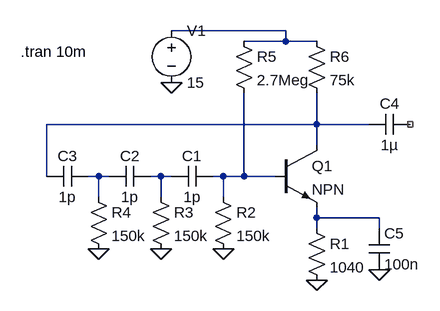
[diagram p0: schematic Project1.asc]
Project1.asc, the LTspice schematic file:
Version 4
SHEET 1 880 680
WIRE 176 -64 0 -64
WIRE 176 -48 176 -64
WIRE 176 -48 112 -48
WIRE 224 -48 176 -48
WIRE 224 80 224 32
WIRE 224 80 -192 80
WIRE 304 80 224 80
WIRE 224 112 224 80
WIRE -192 160 -192 80
WIRE -112 160 -128 160
WIRE -96 160 -112 160
WIRE -16 160 -32 160
WIRE 0 160 -16 160
WIRE 80 160 64 160
WIRE 112 160 112 32
WIRE 112 160 80 160
WIRE 160 160 112 160
WIRE -112 192 -112 160
WIRE -16 192 -16 160
WIRE 80 192 80 160
WIRE 224 224 224 208
WIRE 320 224 224 224
WIRE 224 240 224 224
WIRE 320 240 320 224
FLAG 0 16 0
FLAG -112 272 0
FLAG -16 272 0
FLAG 80 272 0
FLAG 224 320 0
FLAG 320 304 0
SYMBOL npn 160 112 R0
SYMATTR InstName Q1
SYMBOL res 208 224 R0
SYMATTR InstName R1
SYMATTR Value 1040
SYMBOL res 64 176 R0
SYMATTR InstName R2
SYMATTR Value 150k
SYMBOL res -32 176 R0
SYMATTR InstName R3
SYMATTR Value 150k
SYMBOL res -128 176 R0
SYMATTR InstName R4
SYMATTR Value 150k
SYMBOL cap 64 144 R90
WINDOW 0 0 32 VBottom 2
WINDOW 3 32 32 VTop 2
SYMATTR InstName C1
SYMATTR Value 1p
SYMBOL cap -32 144 R90
WINDOW 0 0 32 VBottom 2
WINDOW 3 32 32 VTop 2
SYMATTR InstName C2
SYMATTR Value 1p
SYMBOL cap -128 144 R90
WINDOW 0 0 32 VBottom 2
WINDOW 3 32 32 VTop 2
SYMATTR InstName C3
SYMATTR Value 1p
SYMBOL res 96 -64 R0
SYMATTR InstName R5
SYMATTR Value 2.7Meg
SYMBOL res 208 -64 R0
SYMATTR InstName R6
SYMATTR Value 75k
SYMBOL cap 368 64 R90
WINDOW 0 0 32 VBottom 2
WINDOW 3 32 32 VTop 2
SYMATTR InstName C4
SYMATTR Value 1µ
SYMBOL voltage 0 -80 R0
WINDOW 123 0 0 Left 0
WINDOW 39 0 0 Left 0
SYMATTR InstName V1
SYMATTR Value 15
SYMBOL cap 304 240 R0
SYMATTR InstName C5
SYMATTR Value 100n
TEXT -232 -32 Left 2 !.tran 10m

The netlist it stands for:
* Project1.asc
Q1 N002 N005 N006 0 NPN
R1 N006 0 1040
R2 N005 0 150k
R3 N004 0 150k
R4 N003 0 150k
C1 N005 N004 1p
C2 N004 N003 1p
C3 N003 N002 1p
R5 N001 N005 2.7Meg
R6 N001 N002 75k
C4 NC_01 N002 1µ
V1 N001 0 15
C5 N006 0 100n
.model NPN NPN
.model PNP PNP
.lib standard.bjt
.tran 10m
.backanno
.end